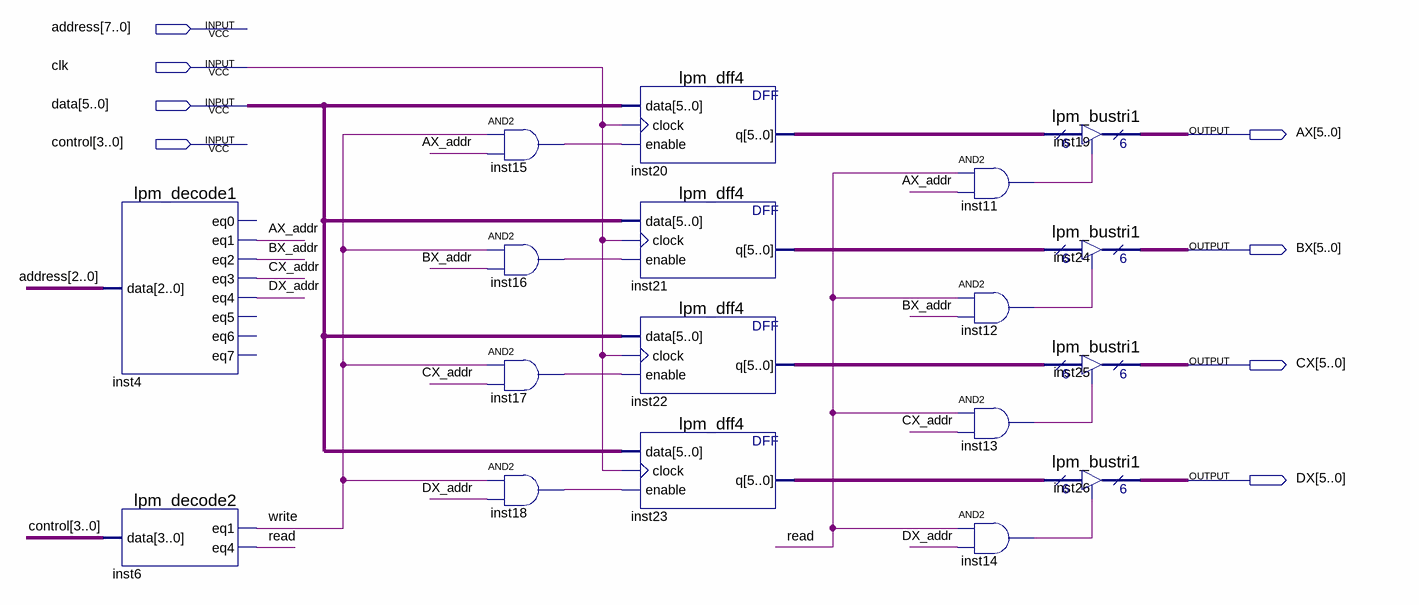
[diagram p0: schematic sheet]
// Quartus schematic register_block.bdf as structural Verilog: 18 symbols, 8 pins
module register_block (
  input  [7:0] address,
  input  clk,
  input  [5:0] data,
  input  [3:0] control,
  output [5:0] AX,
  output [5:0] BX,
  output [5:0] CX,
  output [5:0] DX
);

  wire AX_addr, BX_addr, CX_addr, DX_addr, inst11_out, inst12_out, inst13_out, inst14_out, inst15_out,
       inst16_out, inst17_out, inst18_out, read, write;
  wire [5:0] inst20_q, inst21_q, inst22_q, inst23_q;

  lpm_decode1 inst4 (
    .data(address[2:0]), .eq1(AX_addr), .eq2(BX_addr), .eq3(CX_addr), .eq4(DX_addr));  // open: eq0, eq5, eq6, eq7
  lpm_decode2 inst6 (.data(control), .eq1(write), .eq4(read));
  and inst15 (inst15_out, write, AX_addr);
  and inst16 (inst16_out, write, BX_addr);
  and inst17 (inst17_out, write, CX_addr);
  and inst18 (inst18_out, write, DX_addr);
  lpm_dff4 inst20 (.data(data), .clock(clk), .enable(inst15_out), .q(inst20_q));
  lpm_dff4 inst21 (.data(data), .clock(clk), .enable(inst16_out), .q(inst21_q));
  lpm_dff4 inst22 (.data(data), .clock(clk), .enable(inst17_out), .q(inst22_q));
  lpm_dff4 inst23 (.data(data), .clock(clk), .enable(inst18_out), .q(inst23_q));
  and inst11 (inst11_out, read, AX_addr);
  and inst12 (inst12_out, read, BX_addr);
  and inst13 (inst13_out, read, CX_addr);
  and inst14 (inst14_out, read, DX_addr);
  lpm_bustri1 inst19 (.enabledt(inst11_out), .data(inst20_q), .tridata(AX));
  lpm_bustri1 inst24 (.enabledt(inst12_out), .data(inst21_q), .tridata(BX));
  lpm_bustri1 inst25 (.enabledt(inst13_out), .data(inst22_q), .tridata(CX));
  lpm_bustri1 inst26 (.enabledt(inst14_out), .data(inst23_q), .tridata(DX));
endmodule
